# Altium project RockerBox.PrjPCB (part 2 of 2)

## Sheet SMPS.SchDoc: Title
size A1; Date: Date; CompanyName: Integrated Micro-Electronics Bulgaria; Organization: Design & Development Department; Address1: Drawing Type; Address2: Address 1; Address3: Address 2; Address4: Address 3; DocumentNumber: 730xxx; Revision: 01; SheetNumber: 1; SheetTotal: 1; PageSetup: Record=PageOptions|CenterHorizontal=True|CenterVertical=True|PrintScale=0.70|XCorrection=1.00|YCorrection=1.00|PrintKind=2|BorderSize=5000000|LeftOffset=0|BottomOffset=0|Orientation=2|PaperLength=1000|PaperWidth=1000|Scale=100|PaperSource=7|PrintQuality=-4|MediaType=1|DitherType=10|PaperKind=A4|PrintScaleMode=1; SheetSize: A3; Time: Time; ModifiedDate: Mod. Date
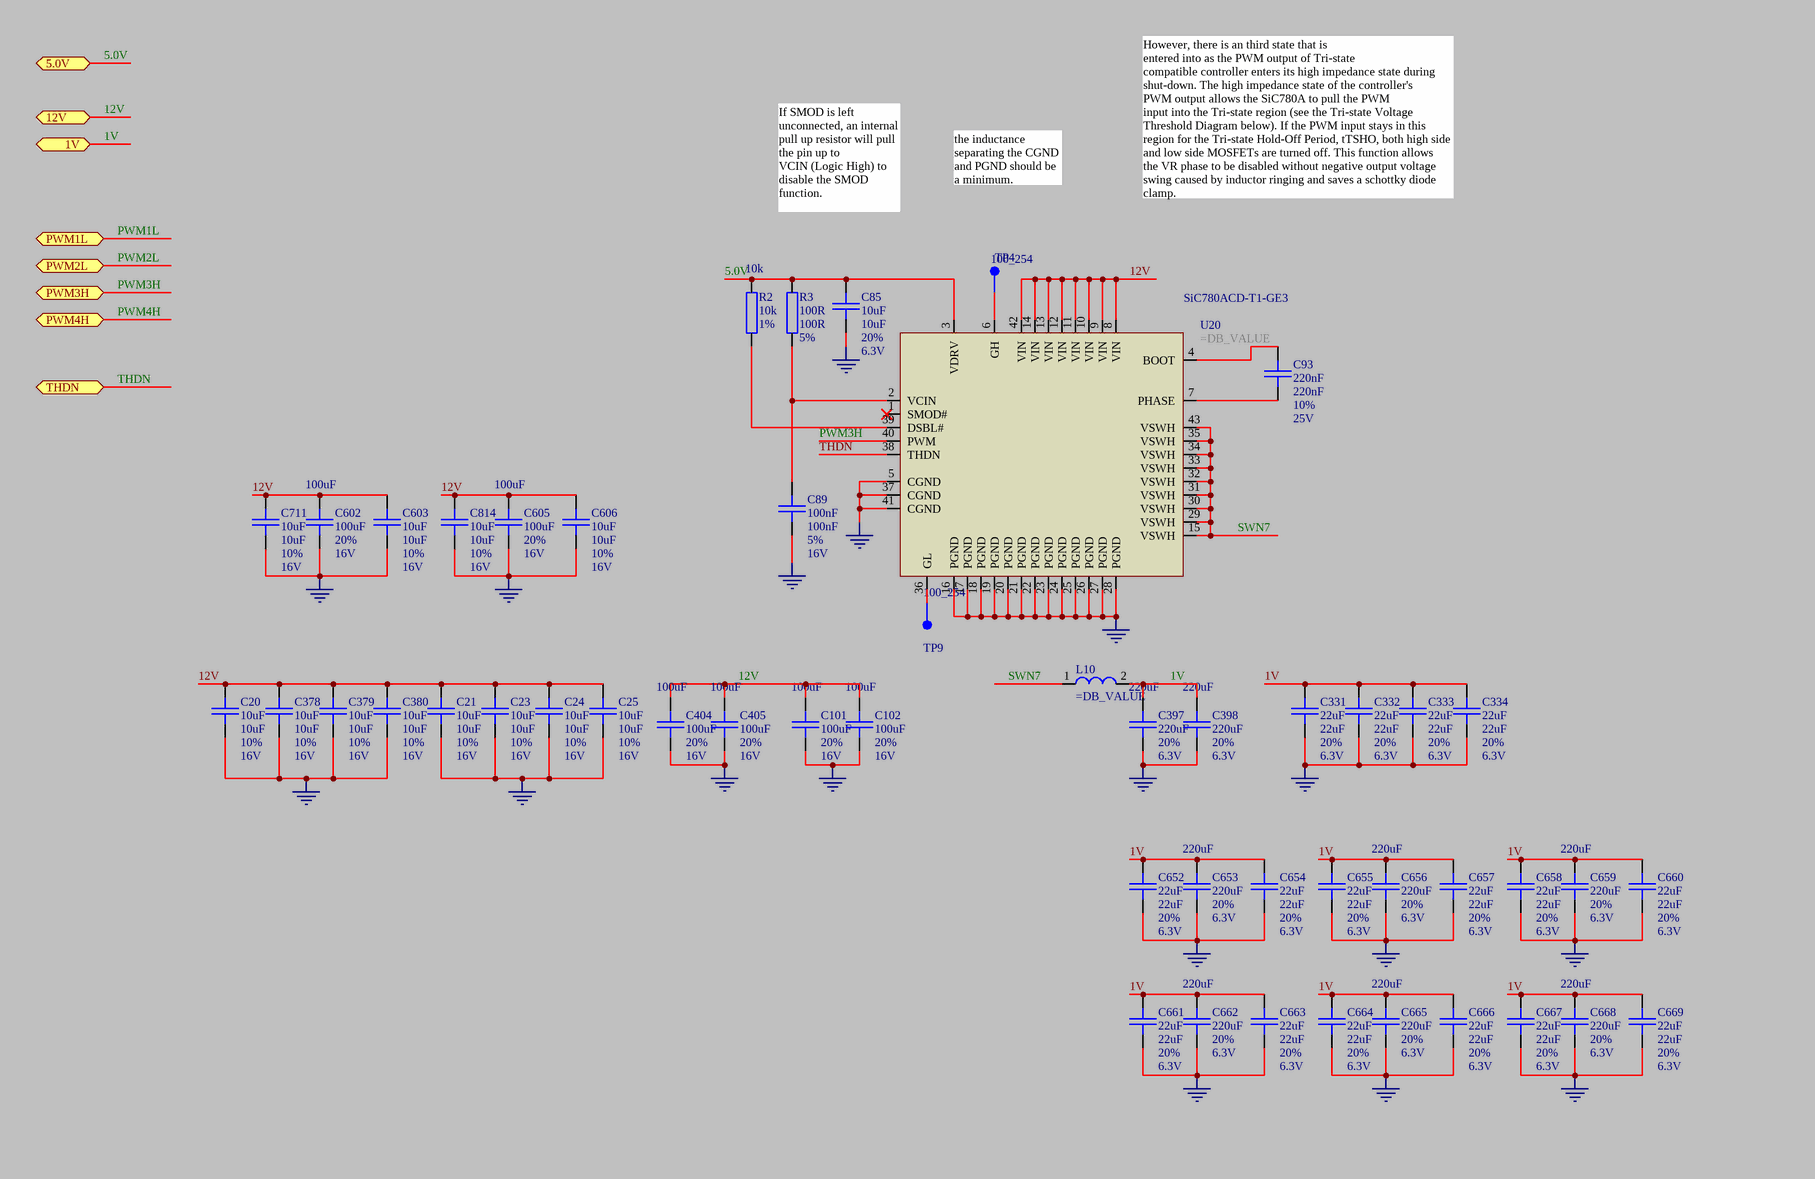
[diagram p4: SMPS.SchDoc, top left]
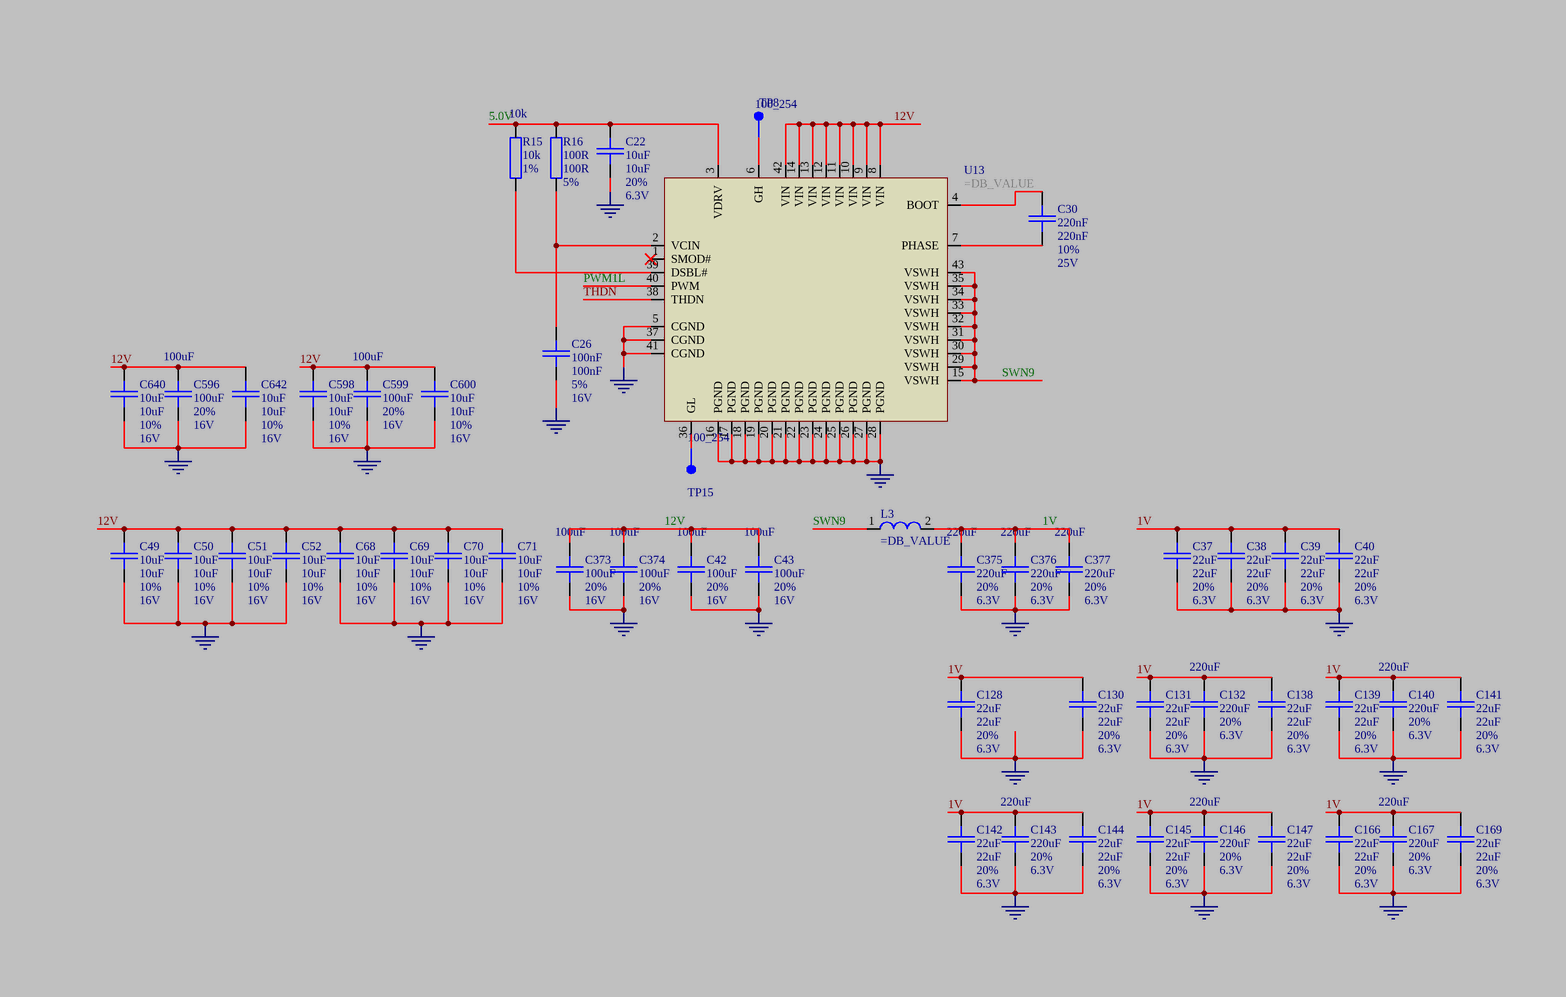
[diagram p5: SMPS.SchDoc, top right]
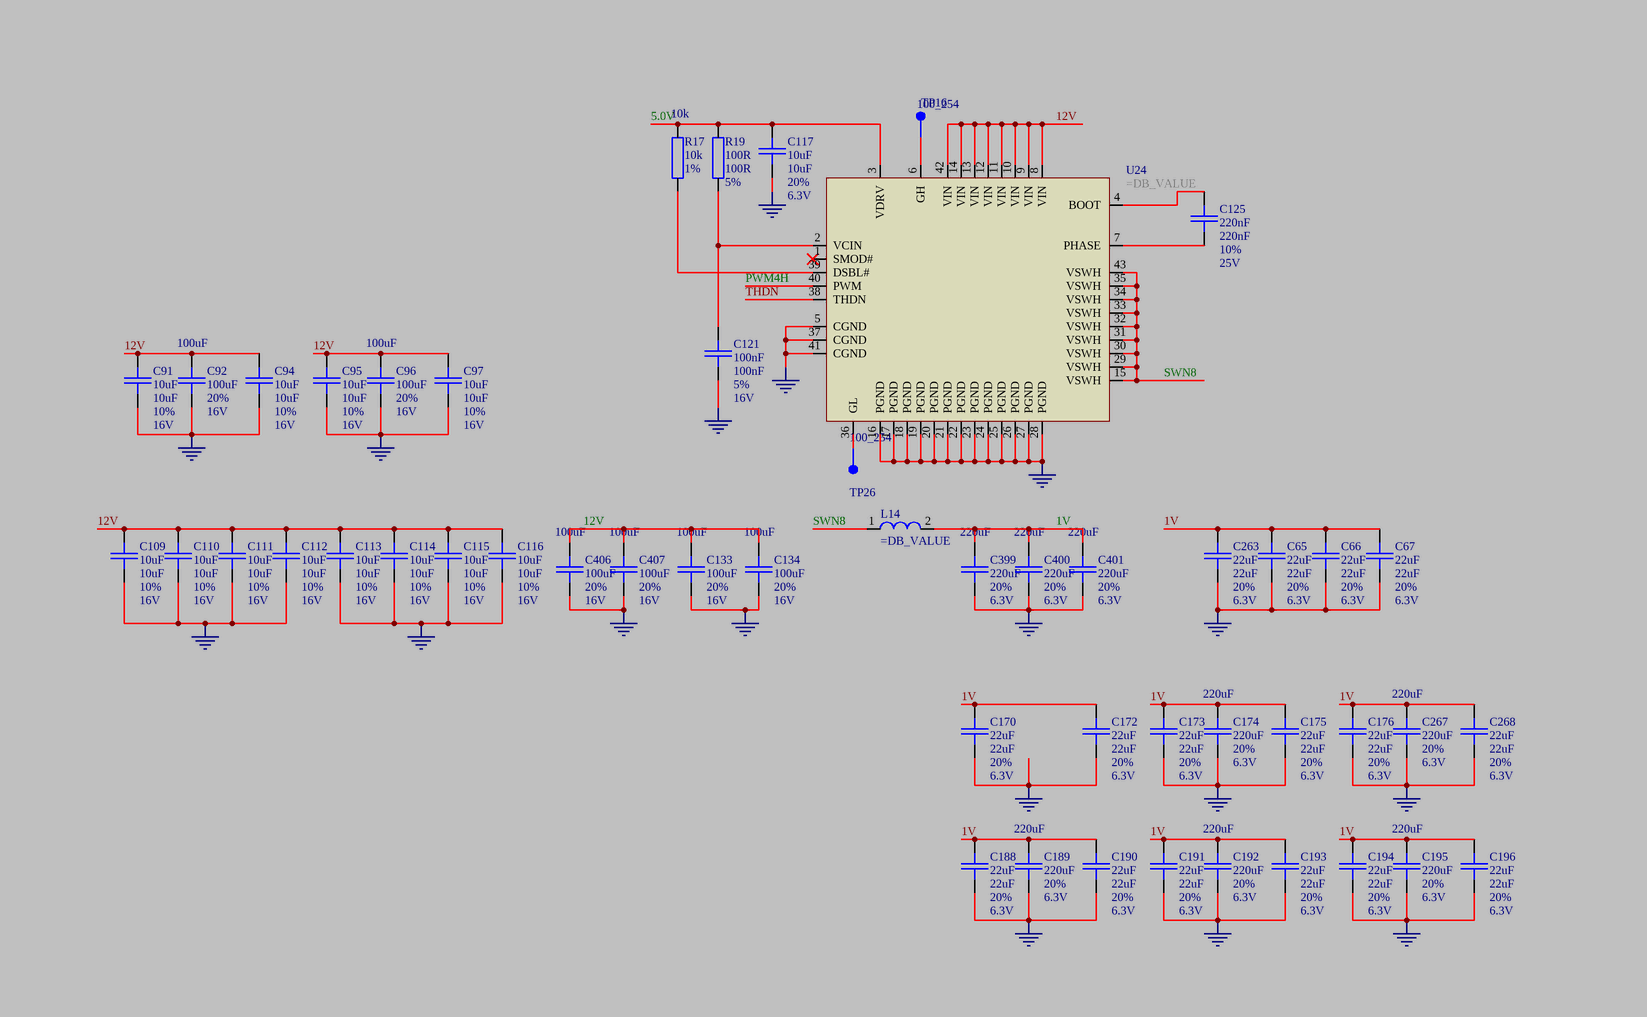
[diagram p6: SMPS.SchDoc, bottom left]
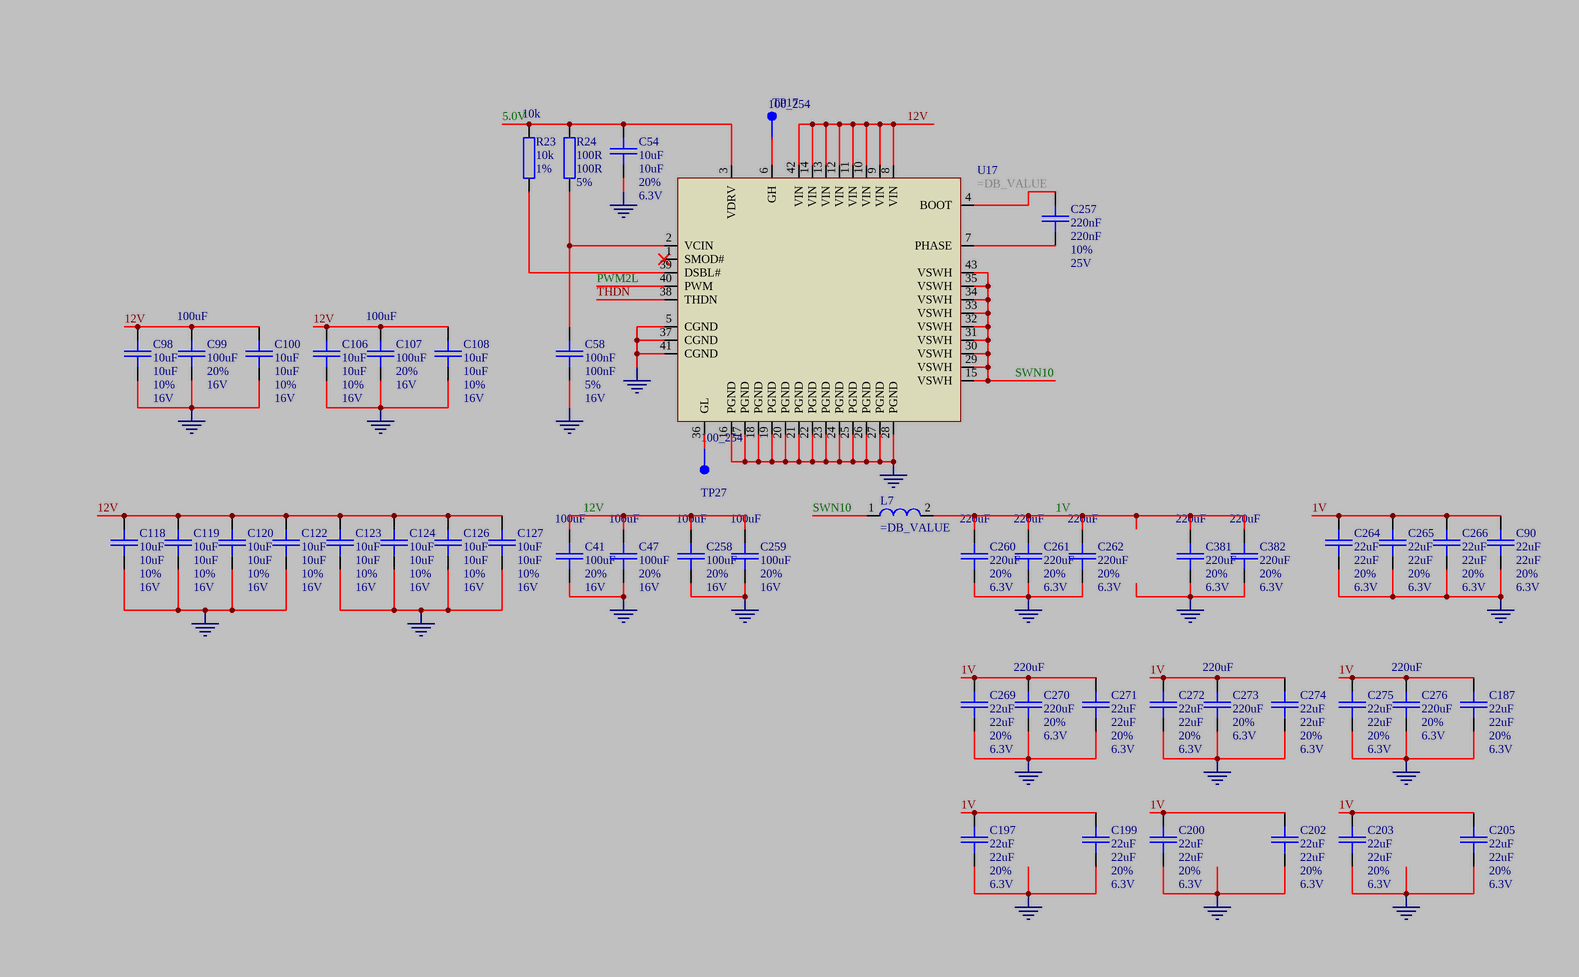
[diagram p7: SMPS.SchDoc, bottom right]

### Parts
C20  10uF  DB_TOLERANCE: 10%  DB_VOLTAGE: 16V  [SMD_0805_CAPC2012X145N]
C21  10uF  DB_TOLERANCE: 10%  DB_VOLTAGE: 16V  [SMD_0805_CAPC2012X145N]
C22  10uF  DB_TOLERANCE: 20%  DB_VOLTAGE: 6.3V  [SMD_0603_CAPC1608X95N]
C23  10uF  DB_TOLERANCE: 10%  DB_VOLTAGE: 16V  [SMD_0805_CAPC2012X145N]
C24  10uF  DB_TOLERANCE: 10%  DB_VOLTAGE: 16V  [SMD_0805_CAPC2012X145N]
C25  10uF  DB_TOLERANCE: 10%  DB_VOLTAGE: 16V  [SMD_0805_CAPC2012X145N]
C26  100nF  DB_TOLERANCE: 5%  DB_VOLTAGE: 16V  [SMD_0603_CAPC1608X95N]
C30  220nF  DB_TOLERANCE: 10%  DB_VOLTAGE: 25V  [SMD_0603_CAPC1608X95N]
C37  22uF  DB_TOLERANCE: 20%  DB_VOLTAGE: 6.3V  [SMD_0805_CAPC2012X145N]
C38  22uF  DB_TOLERANCE: 20%  DB_VOLTAGE: 6.3V  [SMD_0805_CAPC2012X145N]
C39  22uF  DB_TOLERANCE: 20%  DB_VOLTAGE: 6.3V  [SMD_0805_CAPC2012X145N]
C40  22uF  DB_TOLERANCE: 20%  DB_VOLTAGE: 6.3V  [SMD_0805_CAPC2012X145N]
C41  100uF  DB_TOLERANCE: 20%  DB_VOLTAGE: 16V  [SMD_1210_CAPC3225X270N]
C42  100uF  DB_TOLERANCE: 20%  DB_VOLTAGE: 16V  [SMD_1210_CAPC3225X270N]
C43  100uF  DB_TOLERANCE: 20%  DB_VOLTAGE: 16V  [SMD_1210_CAPC3225X270N]
C47  100uF  DB_TOLERANCE: 20%  DB_VOLTAGE: 16V  [SMD_1210_CAPC3225X270N]
C49  10uF  DB_TOLERANCE: 10%  DB_VOLTAGE: 16V  [SMD_0805_CAPC2012X145N]
C50  10uF  DB_TOLERANCE: 10%  DB_VOLTAGE: 16V  [SMD_0805_CAPC2012X145N]
C51  10uF  DB_TOLERANCE: 10%  DB_VOLTAGE: 16V  [SMD_0805_CAPC2012X145N]
C52  10uF  DB_TOLERANCE: 10%  DB_VOLTAGE: 16V  [SMD_0805_CAPC2012X145N]
C54  10uF  DB_TOLERANCE: 20%  DB_VOLTAGE: 6.3V  [SMD_0603_CAPC1608X95N]
C58  100nF  DB_TOLERANCE: 5%  DB_VOLTAGE: 16V  [SMD_0603_CAPC1608X95N]
C65  22uF  DB_TOLERANCE: 20%  DB_VOLTAGE: 6.3V  [SMD_0805_CAPC2012X145N]
C66  22uF  DB_TOLERANCE: 20%  DB_VOLTAGE: 6.3V  [SMD_0805_CAPC2012X145N]
C67  22uF  DB_TOLERANCE: 20%  DB_VOLTAGE: 6.3V  [SMD_0805_CAPC2012X145N]
C68  10uF  DB_TOLERANCE: 10%  DB_VOLTAGE: 16V  [SMD_0805_CAPC2012X145N]
C69  10uF  DB_TOLERANCE: 10%  DB_VOLTAGE: 16V  [SMD_0805_CAPC2012X145N]
C70  10uF  DB_TOLERANCE: 10%  DB_VOLTAGE: 16V  [SMD_0805_CAPC2012X145N]
C71  10uF  DB_TOLERANCE: 10%  DB_VOLTAGE: 16V  [SMD_0805_CAPC2012X145N]
C85  10uF  DB_TOLERANCE: 20%  DB_VOLTAGE: 6.3V  [SMD_0603_CAPC1608X95N]
C89  100nF  DB_TOLERANCE: 5%  DB_VOLTAGE: 16V  [SMD_0603_CAPC1608X95N]
C90  22uF  DB_TOLERANCE: 20%  DB_VOLTAGE: 6.3V  [SMD_0805_CAPC2012X145N]
C91  10uF  DB_TOLERANCE: 10%  DB_VOLTAGE: 16V  [SMD_0805_CAPC2012X145N]
C92  100uF  DB_TOLERANCE: 20%  DB_VOLTAGE: 16V  [SMD_1210_CAPC3225X270N]
C93  220nF  DB_TOLERANCE: 10%  DB_VOLTAGE: 25V  [SMD_0603_CAPC1608X95N]
C94  10uF  DB_TOLERANCE: 10%  DB_VOLTAGE: 16V  [SMD_0805_CAPC2012X145N]
C95  10uF  DB_TOLERANCE: 10%  DB_VOLTAGE: 16V  [SMD_0805_CAPC2012X145N]
C96  100uF  DB_TOLERANCE: 20%  DB_VOLTAGE: 16V  [SMD_1210_CAPC3225X270N]
C97  10uF  DB_TOLERANCE: 10%  DB_VOLTAGE: 16V  [SMD_0805_CAPC2012X145N]
C98  10uF  DB_TOLERANCE: 10%  DB_VOLTAGE: 16V  [SMD_0805_CAPC2012X145N]
C99  100uF  DB_TOLERANCE: 20%  DB_VOLTAGE: 16V  [SMD_1210_CAPC3225X270N]
C100  10uF  DB_TOLERANCE: 10%  DB_VOLTAGE: 16V  [SMD_0805_CAPC2012X145N]
C101  100uF  DB_TOLERANCE: 20%  DB_VOLTAGE: 16V  [SMD_1210_CAPC3225X270N]
C102  100uF  DB_TOLERANCE: 20%  DB_VOLTAGE: 16V  [SMD_1210_CAPC3225X270N]
C106  10uF  DB_TOLERANCE: 10%  DB_VOLTAGE: 16V  [SMD_0805_CAPC2012X145N]
C107  100uF  DB_TOLERANCE: 20%  DB_VOLTAGE: 16V  [SMD_1210_CAPC3225X270N]
C108  10uF  DB_TOLERANCE: 10%  DB_VOLTAGE: 16V  [SMD_0805_CAPC2012X145N]
C109  10uF  DB_TOLERANCE: 10%  DB_VOLTAGE: 16V  [SMD_0805_CAPC2012X145N]
C110  10uF  DB_TOLERANCE: 10%  DB_VOLTAGE: 16V  [SMD_0805_CAPC2012X145N]
C111  10uF  DB_TOLERANCE: 10%  DB_VOLTAGE: 16V  [SMD_0805_CAPC2012X145N]
C112  10uF  DB_TOLERANCE: 10%  DB_VOLTAGE: 16V  [SMD_0805_CAPC2012X145N]
C113  10uF  DB_TOLERANCE: 10%  DB_VOLTAGE: 16V  [SMD_0805_CAPC2012X145N]
C114  10uF  DB_TOLERANCE: 10%  DB_VOLTAGE: 16V  [SMD_0805_CAPC2012X145N]
C115  10uF  DB_TOLERANCE: 10%  DB_VOLTAGE: 16V  [SMD_0805_CAPC2012X145N]
C116  10uF  DB_TOLERANCE: 10%  DB_VOLTAGE: 16V  [SMD_0805_CAPC2012X145N]
C117  10uF  DB_TOLERANCE: 20%  DB_VOLTAGE: 6.3V  [SMD_0603_CAPC1608X95N]
C118  10uF  DB_TOLERANCE: 10%  DB_VOLTAGE: 16V  [SMD_0805_CAPC2012X145N]
C119  10uF  DB_TOLERANCE: 10%  DB_VOLTAGE: 16V  [SMD_0805_CAPC2012X145N]
C120  10uF  DB_TOLERANCE: 10%  DB_VOLTAGE: 16V  [SMD_0805_CAPC2012X145N]
C121  100nF  DB_TOLERANCE: 5%  DB_VOLTAGE: 16V  [SMD_0603_CAPC1608X95N]
C122  10uF  DB_TOLERANCE: 10%  DB_VOLTAGE: 16V  [SMD_0805_CAPC2012X145N]
C123  10uF  DB_TOLERANCE: 10%  DB_VOLTAGE: 16V  [SMD_0805_CAPC2012X145N]
C124  10uF  DB_TOLERANCE: 10%  DB_VOLTAGE: 16V  [SMD_0805_CAPC2012X145N]
C125  220nF  DB_TOLERANCE: 10%  DB_VOLTAGE: 25V  [SMD_0603_CAPC1608X95N]
C126  10uF  DB_TOLERANCE: 10%  DB_VOLTAGE: 16V  [SMD_0805_CAPC2012X145N]
C127  10uF  DB_TOLERANCE: 10%  DB_VOLTAGE: 16V  [SMD_0805_CAPC2012X145N]
C128  22uF  DB_TOLERANCE: 20%  DB_VOLTAGE: 6.3V  [SMD_0805_CAPC2012X145N]
C130  22uF  DB_TOLERANCE: 20%  DB_VOLTAGE: 6.3V  [SMD_0805_CAPC2012X145N]
C131  22uF  DB_TOLERANCE: 20%  DB_VOLTAGE: 6.3V  [SMD_0805_CAPC2012X145N]
C132  220uF  DB_TOLERANCE: 20%  DB_VOLTAGE: 6.3V  [SMD_1210_CAPC3225X279N]
C133  100uF  DB_TOLERANCE: 20%  DB_VOLTAGE: 16V  [SMD_1210_CAPC3225X270N]
C134  100uF  DB_TOLERANCE: 20%  DB_VOLTAGE: 16V  [SMD_1210_CAPC3225X270N]
C138  22uF  DB_TOLERANCE: 20%  DB_VOLTAGE: 6.3V  [SMD_0805_CAPC2012X145N]
C139  22uF  DB_TOLERANCE: 20%  DB_VOLTAGE: 6.3V  [SMD_0805_CAPC2012X145N]
C140  220uF  DB_TOLERANCE: 20%  DB_VOLTAGE: 6.3V  [SMD_1210_CAPC3225X279N]
C141  22uF  DB_TOLERANCE: 20%  DB_VOLTAGE: 6.3V  [SMD_0805_CAPC2012X145N]
C142  22uF  DB_TOLERANCE: 20%  DB_VOLTAGE: 6.3V  [SMD_0805_CAPC2012X145N]
C143  220uF  DB_TOLERANCE: 20%  DB_VOLTAGE: 6.3V  [SMD_1210_CAPC3225X279N]
C144  22uF  DB_TOLERANCE: 20%  DB_VOLTAGE: 6.3V  [SMD_0805_CAPC2012X145N]
C145  22uF  DB_TOLERANCE: 20%  DB_VOLTAGE: 6.3V  [SMD_0805_CAPC2012X145N]
C146  220uF  DB_TOLERANCE: 20%  DB_VOLTAGE: 6.3V  [SMD_1210_CAPC3225X279N]
C147  22uF  DB_TOLERANCE: 20%  DB_VOLTAGE: 6.3V  [SMD_0805_CAPC2012X145N]
C166  22uF  DB_TOLERANCE: 20%  DB_VOLTAGE: 6.3V  [SMD_0805_CAPC2012X145N]
C167  220uF  DB_TOLERANCE: 20%  DB_VOLTAGE: 6.3V  [SMD_1210_CAPC3225X279N]
C169  22uF  DB_TOLERANCE: 20%  DB_VOLTAGE: 6.3V  [SMD_0805_CAPC2012X145N]
C170  22uF  DB_TOLERANCE: 20%  DB_VOLTAGE: 6.3V  [SMD_0805_CAPC2012X145N]
C172  22uF  DB_TOLERANCE: 20%  DB_VOLTAGE: 6.3V  [SMD_0805_CAPC2012X145N]
C173  22uF  DB_TOLERANCE: 20%  DB_VOLTAGE: 6.3V  [SMD_0805_CAPC2012X145N]
C174  220uF  DB_TOLERANCE: 20%  DB_VOLTAGE: 6.3V  [SMD_1210_CAPC3225X279N]
C175  22uF  DB_TOLERANCE: 20%  DB_VOLTAGE: 6.3V  [SMD_0805_CAPC2012X145N]
C176  22uF  DB_TOLERANCE: 20%  DB_VOLTAGE: 6.3V  [SMD_0805_CAPC2012X145N]
C187  22uF  DB_TOLERANCE: 20%  DB_VOLTAGE: 6.3V  [SMD_0805_CAPC2012X145N]
C188  22uF  DB_TOLERANCE: 20%  DB_VOLTAGE: 6.3V  [SMD_0805_CAPC2012X145N]
C189  220uF  DB_TOLERANCE: 20%  DB_VOLTAGE: 6.3V  [SMD_1210_CAPC3225X279N]
C190  22uF  DB_TOLERANCE: 20%  DB_VOLTAGE: 6.3V  [SMD_0805_CAPC2012X145N]
C191  22uF  DB_TOLERANCE: 20%  DB_VOLTAGE: 6.3V  [SMD_0805_CAPC2012X145N]
C192  220uF  DB_TOLERANCE: 20%  DB_VOLTAGE: 6.3V  [SMD_1210_CAPC3225X279N]
C193  22uF  DB_TOLERANCE: 20%  DB_VOLTAGE: 6.3V  [SMD_0805_CAPC2012X145N]
C194  22uF  DB_TOLERANCE: 20%  DB_VOLTAGE: 6.3V  [SMD_0805_CAPC2012X145N]
C195  220uF  DB_TOLERANCE: 20%  DB_VOLTAGE: 6.3V  [SMD_1210_CAPC3225X279N]
C196  22uF  DB_TOLERANCE: 20%  DB_VOLTAGE: 6.3V  [SMD_0805_CAPC2012X145N]
C197  22uF  DB_TOLERANCE: 20%  DB_VOLTAGE: 6.3V  [SMD_0805_CAPC2012X145N]
C199  22uF  DB_TOLERANCE: 20%  DB_VOLTAGE: 6.3V  [SMD_0805_CAPC2012X145N]
C200  22uF  DB_TOLERANCE: 20%  DB_VOLTAGE: 6.3V  [SMD_0805_CAPC2012X145N]
C202  22uF  DB_TOLERANCE: 20%  DB_VOLTAGE: 6.3V  [SMD_0805_CAPC2012X145N]
C203  22uF  DB_TOLERANCE: 20%  DB_VOLTAGE: 6.3V  [SMD_0805_CAPC2012X145N]
C205  22uF  DB_TOLERANCE: 20%  DB_VOLTAGE: 6.3V  [SMD_0805_CAPC2012X145N]
C257  220nF  DB_TOLERANCE: 10%  DB_VOLTAGE: 25V  [SMD_0603_CAPC1608X95N]
C258  100uF  DB_TOLERANCE: 20%  DB_VOLTAGE: 16V  [SMD_1210_CAPC3225X270N]
C259  100uF  DB_TOLERANCE: 20%  DB_VOLTAGE: 16V  [SMD_1210_CAPC3225X270N]
C260  220uF  DB_TOLERANCE: 20%  DB_VOLTAGE: 6.3V  [SMD_1210_CAPC3225X279N]
C261  220uF  DB_TOLERANCE: 20%  DB_VOLTAGE: 6.3V  [SMD_1210_CAPC3225X279N]
C262  220uF  DB_TOLERANCE: 20%  DB_VOLTAGE: 6.3V  [SMD_1210_CAPC3225X279N]
C263  22uF  DB_TOLERANCE: 20%  DB_VOLTAGE: 6.3V  [SMD_0805_CAPC2012X145N]
C264  22uF  DB_TOLERANCE: 20%  DB_VOLTAGE: 6.3V  [SMD_0805_CAPC2012X145N]
C265  22uF  DB_TOLERANCE: 20%  DB_VOLTAGE: 6.3V  [SMD_0805_CAPC2012X145N]
C266  22uF  DB_TOLERANCE: 20%  DB_VOLTAGE: 6.3V  [SMD_0805_CAPC2012X145N]
C267  220uF  DB_TOLERANCE: 20%  DB_VOLTAGE: 6.3V  [SMD_1210_CAPC3225X279N]
C268  22uF  DB_TOLERANCE: 20%  DB_VOLTAGE: 6.3V  [SMD_0805_CAPC2012X145N]
C269  22uF  DB_TOLERANCE: 20%  DB_VOLTAGE: 6.3V  [SMD_0805_CAPC2012X145N]
C270  220uF  DB_TOLERANCE: 20%  DB_VOLTAGE: 6.3V  [SMD_1210_CAPC3225X279N]
C271  22uF  DB_TOLERANCE: 20%  DB_VOLTAGE: 6.3V  [SMD_0805_CAPC2012X145N]
C272  22uF  DB_TOLERANCE: 20%  DB_VOLTAGE: 6.3V  [SMD_0805_CAPC2012X145N]
C273  220uF  DB_TOLERANCE: 20%  DB_VOLTAGE: 6.3V  [SMD_1210_CAPC3225X279N]
C274  22uF  DB_TOLERANCE: 20%  DB_VOLTAGE: 6.3V  [SMD_0805_CAPC2012X145N]
C275  22uF  DB_TOLERANCE: 20%  DB_VOLTAGE: 6.3V  [SMD_0805_CAPC2012X145N]
C276  220uF  DB_TOLERANCE: 20%  DB_VOLTAGE: 6.3V  [SMD_1210_CAPC3225X279N]
C331  22uF  DB_TOLERANCE: 20%  DB_VOLTAGE: 6.3V  [SMD_0805_CAPC2012X145N]
C332  22uF  DB_TOLERANCE: 20%  DB_VOLTAGE: 6.3V  [SMD_0805_CAPC2012X145N]
C333  22uF  DB_TOLERANCE: 20%  DB_VOLTAGE: 6.3V  [SMD_0805_CAPC2012X145N]
C334  22uF  DB_TOLERANCE: 20%  DB_VOLTAGE: 6.3V  [SMD_0805_CAPC2012X145N]
C373  100uF  DB_TOLERANCE: 20%  DB_VOLTAGE: 16V  [SMD_1210_CAPC3225X270N]
C374  100uF  DB_TOLERANCE: 20%  DB_VOLTAGE: 16V  [SMD_1210_CAPC3225X270N]
C375  220uF  DB_TOLERANCE: 20%  DB_VOLTAGE: 6.3V  [SMD_1210_CAPC3225X279N]
C376  220uF  DB_TOLERANCE: 20%  DB_VOLTAGE: 6.3V  [SMD_1210_CAPC3225X279N]
C377  220uF  DB_TOLERANCE: 20%  DB_VOLTAGE: 6.3V  [SMD_1210_CAPC3225X279N]
C378  10uF  DB_TOLERANCE: 10%  DB_VOLTAGE: 16V  [SMD_0805_CAPC2012X145N]
C379  10uF  DB_TOLERANCE: 10%  DB_VOLTAGE: 16V  [SMD_0805_CAPC2012X145N]
C380  10uF  DB_TOLERANCE: 10%  DB_VOLTAGE: 16V  [SMD_0805_CAPC2012X145N]
C381  220uF  DB_TOLERANCE: 20%  DB_VOLTAGE: 6.3V  [SMD_1210_CAPC3225X279N]
C382  220uF  DB_TOLERANCE: 20%  DB_VOLTAGE: 6.3V  [SMD_1210_CAPC3225X279N]
C397  220uF  DB_TOLERANCE: 20%  DB_VOLTAGE: 6.3V  [SMD_1210_CAPC3225X279N]
C398  220uF  DB_TOLERANCE: 20%  DB_VOLTAGE: 6.3V  [SMD_1210_CAPC3225X279N]
C399  220uF  DB_TOLERANCE: 20%  DB_VOLTAGE: 6.3V  [SMD_1210_CAPC3225X279N]
C400  220uF  DB_TOLERANCE: 20%  DB_VOLTAGE: 6.3V  [SMD_1210_CAPC3225X279N]
C401  220uF  DB_TOLERANCE: 20%  DB_VOLTAGE: 6.3V  [SMD_1210_CAPC3225X279N]
C404  100uF  DB_TOLERANCE: 20%  DB_VOLTAGE: 16V  [SMD_1210_CAPC3225X270N]
C405  100uF  DB_TOLERANCE: 20%  DB_VOLTAGE: 16V  [SMD_1210_CAPC3225X270N]
C406  100uF  DB_TOLERANCE: 20%  DB_VOLTAGE: 16V  [SMD_1210_CAPC3225X270N]
C407  100uF  DB_TOLERANCE: 20%  DB_VOLTAGE: 16V  [SMD_1210_CAPC3225X270N]
C596  100uF  DB_TOLERANCE: 20%  DB_VOLTAGE: 16V  [SMD_1210_CAPC3225X270N]
C598  10uF  DB_TOLERANCE: 10%  DB_VOLTAGE: 16V  [SMD_0805_CAPC2012X145N]
C599  100uF  DB_TOLERANCE: 20%  DB_VOLTAGE: 16V  [SMD_1210_CAPC3225X270N]
C600  10uF  DB_TOLERANCE: 10%  DB_VOLTAGE: 16V  [SMD_0805_CAPC2012X145N]
C602  100uF  DB_TOLERANCE: 20%  DB_VOLTAGE: 16V  [SMD_1210_CAPC3225X270N]
C603  10uF  DB_TOLERANCE: 10%  DB_VOLTAGE: 16V  [SMD_0805_CAPC2012X145N]
C605  100uF  DB_TOLERANCE: 20%  DB_VOLTAGE: 16V  [SMD_1210_CAPC3225X270N]
C606  10uF  DB_TOLERANCE: 10%  DB_VOLTAGE: 16V  [SMD_0805_CAPC2012X145N]
C640  10uF  DB_TOLERANCE: 10%  DB_VOLTAGE: 16V  [SMD_0805_CAPC2012X145N]
C642  10uF  DB_TOLERANCE: 10%  DB_VOLTAGE: 16V  [SMD_0805_CAPC2012X145N]
C652  22uF  DB_TOLERANCE: 20%  DB_VOLTAGE: 6.3V  [SMD_0805_CAPC2012X145N]
C653  220uF  DB_TOLERANCE: 20%  DB_VOLTAGE: 6.3V  [SMD_1210_CAPC3225X279N]
C654  22uF  DB_TOLERANCE: 20%  DB_VOLTAGE: 6.3V  [SMD_0805_CAPC2012X145N]
C655  22uF  DB_TOLERANCE: 20%  DB_VOLTAGE: 6.3V  [SMD_0805_CAPC2012X145N]
C656  220uF  DB_TOLERANCE: 20%  DB_VOLTAGE: 6.3V  [SMD_1210_CAPC3225X279N]
C657  22uF  DB_TOLERANCE: 20%  DB_VOLTAGE: 6.3V  [SMD_0805_CAPC2012X145N]
C658  22uF  DB_TOLERANCE: 20%  DB_VOLTAGE: 6.3V  [SMD_0805_CAPC2012X145N]
C659  220uF  DB_TOLERANCE: 20%  DB_VOLTAGE: 6.3V  [SMD_1210_CAPC3225X279N]
C660  22uF  DB_TOLERANCE: 20%  DB_VOLTAGE: 6.3V  [SMD_0805_CAPC2012X145N]
C661  22uF  DB_TOLERANCE: 20%  DB_VOLTAGE: 6.3V  [SMD_0805_CAPC2012X145N]
C662  220uF  DB_TOLERANCE: 20%  DB_VOLTAGE: 6.3V  [SMD_1210_CAPC3225X279N]
C663  22uF  DB_TOLERANCE: 20%  DB_VOLTAGE: 6.3V  [SMD_0805_CAPC2012X145N]
C664  22uF  DB_TOLERANCE: 20%  DB_VOLTAGE: 6.3V  [SMD_0805_CAPC2012X145N]
C665  220uF  DB_TOLERANCE: 20%  DB_VOLTAGE: 6.3V  [SMD_1210_CAPC3225X279N]
C666  22uF  DB_TOLERANCE: 20%  DB_VOLTAGE: 6.3V  [SMD_0805_CAPC2012X145N]
C667  22uF  DB_TOLERANCE: 20%  DB_VOLTAGE: 6.3V  [SMD_0805_CAPC2012X145N]
C668  220uF  DB_TOLERANCE: 20%  DB_VOLTAGE: 6.3V  [SMD_1210_CAPC3225X279N]
C669  22uF  DB_TOLERANCE: 20%  DB_VOLTAGE: 6.3V  [SMD_0805_CAPC2012X145N]
C711  10uF  DB_TOLERANCE: 10%  DB_VOLTAGE: 16V  [SMD_0805_CAPC2012X145N]
C814  10uF  DB_TOLERANCE: 10%  DB_VOLTAGE: 16V  [SMD_0805_CAPC2012X145N]
L3  (no value)  [SMT_INDM135130X800N]
L7  (no value)  [SMT_INDM135130X800N]
L10  (no value)  [SMT_INDM135130X800N]
L14  (no value)  [SMT_INDM135130X800N]
R2  10k  DB_TOLERANCE: 1%  [SMD_0603_RESC1608X55N]
R3  100R  DB_TOLERANCE: 5%  [SMD_0603_RESC1608X55N]
R15  10k  DB_TOLERANCE: 1%  [SMD_0603_RESC1608X55N]
R16  100R  DB_TOLERANCE: 5%  [SMD_0603_RESC1608X55N]
R17  10k  DB_TOLERANCE: 1%  [SMD_0603_RESC1608X55N]
R19  100R  DB_TOLERANCE: 5%  [SMD_0603_RESC1608X55N]
R23  10k  DB_TOLERANCE: 1%  [SMD_0603_RESC1608X55N]
R24  100R  DB_TOLERANCE: 5%  [SMD_0603_RESC1608X55N]
TP4  100_254  [SMD_TP_100-254]
TP8  100_254  [SMD_TP_100-254]
TP9  100_254  [SMD_TP_100-254]
TP15  100_254  [SMD_TP_100-254]
TP16  100_254  [SMD_TP_100-254]
TP17  100_254  [SMD_TP_100-254]
TP26  100_254  [SMD_TP_100-254]
TP27  100_254  [SMD_TP_100-254]
U13  (no value)  [SMD_QFN50P600X600X80-43]
U17  (no value)  [SMD_QFN50P600X600X80-43]
U20  (no value)  [SMD_QFN50P600X600X80-43]
U24  (no value)  [SMD_QFN50P600X600X80-43]

### Ports
1V, 5.0V, 12V, PWM1L, PWM2L, PWM3H, PWM4H, THDN

### Nets
GND: C20.2 C21.2 C22.1 C23.2 C24.2 C25.2 C26.2 C37.2 C38.2 C39.2 C40.2 C41.1 C42.1 C43.1 C47.1 C49.2 C50.2 C51.2 C52.2 C54.1 C58.2 C65.2 C66.2 C67.2 C68.2 C69.2 C70.2 C71.2 C85.1 C89.2 C90.2 C91.2 C92.1 C94.2 C95.2 C96.1 C97.2 C98.2 C99.1 C100.2 C101.1 C102.1 C106.2 C107.1 C108.2 C109.2 C110.2 C111.2 C112.2 C113.2 C114.2 C115.2 C116.2 C117.1 C118.2 C119.2 C120.2 C121.2 C122.2 C123.2 C124.2 C126.2 C127.2 C128.2 C130.2 C131.2 C132.1 C133.1 C134.1 C138.2 C139.2 C140.1 C141.2 C142.2 C143.1 C144.2 C145.2 C146.1 C147.2 C166.2 C167.1 C169.2 C170.2 C172.2 C173.2 C174.1 C175.2 C176.2 C187.2 C188.2 C189.1 C190.2 C191.2 C192.1 C193.2 C194.2 C195.1 C196.2 C197.2 C199.2 C200.2 C202.2 C203.2 C205.2 C258.1 C259.1 C260.1 C261.1 C262.1 C263.2 C264.2 C265.2 C266.2 C267.1 C268.2 C269.2 C270.1 C271.2 C272.2 C273.1 C274.2 C275.2 C276.1 C331.2 C332.2 C333.2 C334.2 C373.1 C374.1 C375.1 C376.1 C377.1 C378.2 C379.2 C380.2 C381.1 C382.1 C397.1 C398.1 C399.1 C400.1 C401.1 C404.1 C405.1 C406.1 C407.1 C596.1 C598.2 C599.1 C600.2 C602.1 C603.2 C605.1 C606.2 C640.2 C642.2 C652.2 C653.1 C654.2 C655.2 C656.1 C657.2 C658.2 C659.1 C660.2 C661.2 C662.1 C663.2 C664.2 C665.1 C666.2 C667.2 C668.1 C669.2 C711.2 C814.2 U13.5(CGND) U13.16(PGND) U13.17(PGND) U13.18(PGND) U13.19(PGND) U13.20(PGND) U13.21(PGND) U13.22(PGND) U13.23(PGND) U13.24(PGND) U13.25(PGND) U13.26(PGND) U13.27(PGND) U13.28(PGND) U13.37(CGND) U13.41(CGND) U17.5(CGND) U17.16(PGND) U17.17(PGND) U17.18(PGND) U17.19(PGND) U17.20(PGND) U17.21(PGND) U17.22(PGND) U17.23(PGND) U17.24(PGND) U17.25(PGND) U17.26(PGND) U17.27(PGND) U17.28(PGND) U17.37(CGND) U17.41(CGND) U20.5(CGND) U20.16(PGND) U20.17(PGND) U20.18(PGND) U20.19(PGND) U20.20(PGND) U20.21(PGND) U20.22(PGND) U20.23(PGND) U20.24(PGND) U20.25(PGND) U20.26(PGND) U20.27(PGND) U20.28(PGND) U20.37(CGND) U20.41(CGND) U24.5(CGND) U24.16(PGND) U24.17(PGND) U24.18(PGND) U24.19(PGND) U24.20(PGND) U24.21(PGND) U24.22(PGND) U24.23(PGND) U24.24(PGND) U24.25(PGND) U24.26(PGND) U24.27(PGND) U24.28(PGND) U24.37(CGND) U24.41(CGND)
1V: C37.1 C38.1 C39.1 C40.1 C65.1 C66.1 C67.1 C90.1 C128.1 C130.1 C131.1 C132.2 C138.1 C139.1 C140.2 C141.1 C142.1 C143.2 C144.1 C145.1 C146.2 C147.1 C166.1 C167.2 C169.1 C170.1 C172.1 C173.1 C174.2 C175.1 C176.1 C187.1 C188.1 C189.2 C190.1 C191.1 C192.2 C193.1 C194.1 C195.2 C196.1 C197.1 C199.1 C200.1 C202.1 C203.1 C205.1 C260.2 C261.2 C262.2 C263.1 C264.1 C265.1 C266.1 C267.2 C268.1 C269.1 C270.2 C271.1 C272.1 C273.2 C274.1 C275.1 C276.2 C331.1 C332.1 C333.1 C334.1 C375.2 C376.2 C377.2 C381.2 C382.2 C397.2 C398.2 C399.2 C400.2 C401.2 C652.1 C653.2 C654.1 C655.1 C656.2 C657.1 C658.1 C659.2 C660.1 C661.1 C662.2 C663.1 C664.1 C665.2 C666.1 C667.1 C668.2 C669.1 L3.2 L7.2 L10.2 L14.2 ; port 1V
5.0V: C22.2 C54.2 C85.2 C117.2 R2.2 R3.1 R15.2 R16.1 R17.2 R19.1 R23.2 R24.1 U13.3(VDRV) U17.3(VDRV) U20.3(VDRV) U24.3(VDRV) ; port 5.0V
12V: C20.1 C21.1 C23.1 C24.1 C25.1 C41.2 C42.2 C43.2 C47.2 C49.1 C50.1 C51.1 C52.1 C68.1 C69.1 C70.1 C71.1 C91.1 C92.2 C94.1 C95.1 C96.2 C97.1 C98.1 C99.2 C100.1 C101.2 C102.2 C106.1 C107.2 C108.1 C109.1 C110.1 C111.1 C112.1 C113.1 C114.1 C115.1 C116.1 C118.1 C119.1 C120.1 C122.1 C123.1 C124.1 C126.1 C127.1 C133.2 C134.2 C258.2 C259.2 C373.2 C374.2 C378.1 C379.1 C380.1 C404.2 C405.2 C406.2 C407.2 C596.2 C598.1 C599.2 C600.1 C602.2 C603.1 C605.2 C606.1 C640.1 C642.1 C711.1 C814.1 U13.8(VIN) U13.9(VIN) U13.10(VIN) U13.11(VIN) U13.12(VIN) U13.13(VIN) U13.14(VIN) U13.42(VIN) U17.8(VIN) U17.9(VIN) U17.10(VIN) U17.11(VIN) U17.12(VIN) U17.13(VIN) U17.14(VIN) U17.42(VIN) U20.8(VIN) U20.9(VIN) U20.10(VIN) U20.11(VIN) U20.12(VIN) U20.13(VIN) U20.14(VIN) U20.42(VIN) U24.8(VIN) U24.9(VIN) U24.10(VIN) U24.11(VIN) U24.12(VIN) U24.13(VIN) U24.14(VIN) U24.42(VIN) ; port 12V
PWM1L: U13.40(PWM) ; port PWM1L
PWM2L: U17.40(PWM) ; port PWM2L
PWM3H: U20.40(PWM) ; port PWM3H
PWM4H: U24.40(PWM) ; port PWM4H
SWN7: L10.1 U20.15(VSWH) U20.29(VSWH) U20.30(VSWH) U20.31(VSWH) U20.32(VSWH) U20.33(VSWH) U20.34(VSWH) U20.35(VSWH) U20.43(VSWH)
SWN8: L14.1 U24.15(VSWH) U24.29(VSWH) U24.30(VSWH) U24.31(VSWH) U24.32(VSWH) U24.33(VSWH) U24.34(VSWH) U24.35(VSWH) U24.43(VSWH)
SWN9: L3.1 U13.15(VSWH) U13.29(VSWH) U13.30(VSWH) U13.31(VSWH) U13.32(VSWH) U13.33(VSWH) U13.34(VSWH) U13.35(VSWH) U13.43(VSWH)
SWN10: L7.1 U17.15(VSWH) U17.29(VSWH) U17.30(VSWH) U17.31(VSWH) U17.32(VSWH) U17.33(VSWH) U17.34(VSWH) U17.35(VSWH) U17.43(VSWH)
THDN: U13.38(THDN) U17.38(THDN) U20.38(THDN) U24.38(THDN) ; port THDN
NetC26_1: C26.1 R16.2 U13.2(VCIN)
NetC30_1: C30.1 U13.4(BOOT)
NetC30_2: C30.2 U13.7(PHASE)
NetC58_1: C58.1 R24.2 U17.2(VCIN)
NetC89_1: C89.1 R3.2 U20.2(VCIN)
NetC93_1: C93.1 U20.4(BOOT)
NetC93_2: C93.2 U20.7(PHASE)
NetC121_1: C121.1 R19.2 U24.2(VCIN)
NetC125_1: C125.1 U24.4(BOOT)
NetC125_2: C125.2 U24.7(PHASE)
NetC257_1: C257.1 U17.4(BOOT)
NetC257_2: C257.2 U17.7(PHASE)
NetR2_1: R2.1 U20.39(DSBL#)
NetR15_1: R15.1 U13.39(DSBL#)
NetR17_1: R17.1 U24.39(DSBL#)
NetR23_1: R23.1 U17.39(DSBL#)
NetTP4_1: TP4.1 U20.6(GH)
NetTP8_1: TP8.1 U13.6(GH)
NetTP9_1: TP9.1 U20.36(GL)
NetTP15_1: TP15.1 U13.36(GL)
NetTP16_1: TP16.1 U24.6(GH)
NetTP17_1: TP17.1 U17.6(GH)
NetTP26_1: TP26.1 U24.36(GL)
NetTP27_1: TP27.1 U17.36(GL)

Not connected (* = marked no-connect by the designer): U13 1(SMOD#)*; U17 1(SMOD#)*; U20 1(SMOD#)*; U24 1(SMOD#)*

### Notes on the sheet
- the inductance
  separating the CGND and PGND should be a minimum.
- However, there is an third state that is
  entered into as the PWM output of Tri-state
  compatible controller enters its high impedance state during
  shut-down. The high impedance state of the controller's
  PWM output allows the SiC780A to pull the PWM
  input into the Tri-state region (see the Tri-state Voltage
  Threshold Diagram below). If the PWM input stays in this
  region for the Tri-state Hold-Off Period, tTSHO, both high side
  and low side MOSFETs are turned off. This function allows
  the VR phase to be disabled without negative output voltage
  swing caused by inductor ringing and saves a schottky diode
  clamp.
- If SMOD is left
  unconnected, an internal pull up resistor will pull the pin up to
  VCIN (Logic High) to disable the SMOD function.
- (near U20) SiC780ACD-T1-GE3

### Library data of the parts
C20 C21 C23-C25 C49-C52 C68-C71 C91 C94 C95 C97 C98 C100 C106 C108-C116 C118-C120 C122-C124 C126 C127 C378-C380 C598 C600 C603 C606 C640 C642 C711 C814 = CAP000043636: DB_PART_TYPE: Ceramic_SMD\Standard_X5R; DB_MANUFACTURER_PART: KEMET    C0805C106K4PAC; NOTE: <NOTE>; DB_T_RANGE: -55 to 85; DB_PACKAGE: 0805; DB_DESCRIPTION: C X5R 10uF 10% 16V 0805; DB_CERTIFIED: ISHIDDEN=T; DB_APPROVED_ON: 09.10.2010 г.; DB_STATUS: NEW; DB_PART_NUMBER: CAP000043636; DB_VALUE: 10uF; DB_PCB_DEVICE: SMD_0805_CAPC2012X145N; DB_PRICE: ISHIDDEN=T; DB_LEADTIME: ISHIDDEN=T; DB_MOQ: ISHIDDEN=T; DB_PRICE_DATE: ISHIDDEN=T; DB_APPROVED_BY: ISHIDDEN=T; DB_DATASHEET: http://john.epiqdesign.com/projects/CIS_Datasheets/F3102_CE_Kemet.pdf?rev=92&sc=0
C22 C54 C85 C117 = CAP000043646: DB_MANUFACTURER_PART: KEMET    C0603C106M9PAC; DB_PART_TYPE: Ceramic_SMD\Standard_X5R; NOTE: <NOTE>; DB_APPROVED_BY: ISHIDDEN=T; DB_APPROVED_ON: 09.10.2010 г.; DB_DESCRIPTION: C X5R 10uF 20% 6.3V 0603; DB_PACKAGE: 0603; DB_STATUS: NEW; DB_T_RANGE: -55 to 85; DB_PART_NUMBER: CAP000043646; DB_VALUE: 10uF; DB_CERTIFIED: ISHIDDEN=T; DB_DATASHEET: http://john.epiqdesign.com/projects/CIS_Datasheets/F3102_CE_Kemet.pdf?rev=92&sc=0; DB_LEADTIME: ISHIDDEN=T; DB_MOQ: ISHIDDEN=T; DB_PCB_DEVICE: SMD_0603_CAPC1608X95N; DB_PRICE: ISHIDDEN=T; DB_PRICE_DATE: ISHIDDEN=T
C26 C58 C89 C121 = CAP000022706: DB_PART_TYPE: Ceramic_SMD\Open_Mode_X7R; DB_MANUFACTURER_PART: KEMET    C0603F104J4RAC; NOTE: <NOTE>; DB_T_RANGE: -55 to 125; DB_PACKAGE: 0603; DB_DESCRIPTION: C X7R 100nF 5% 16V 0603; DB_CERTIFIED: ISHIDDEN=T; DB_APPROVED_ON: 09.10.2010 г.; DB_STATUS: NEW; DB_PART_NUMBER: CAP000022706; DB_VALUE: 100nF; DB_PCB_DEVICE: SMD_0603_CAPC1608X95N; DB_PRICE: ISHIDDEN=T; DB_LEADTIME: ISHIDDEN=T; DB_MOQ: ISHIDDEN=T; DB_PRICE_DATE: ISHIDDEN=T; DB_APPROVED_BY: ISHIDDEN=T; DB_DATASHEET: http://john.epiqdesign.com/projects/CIS_Datasheets/F3102_CE_Kemet.pdf?rev=92&sc=0
C30 C93 C125 C257 = CAP000022968: DB_PART_TYPE: Ceramic_SMD\Open_Mode_X7R; DB_MANUFACTURER_PART: KEMET    C0603F224K3RAC; NOTE: <NOTE>; DB_T_RANGE: -55 to 125; DB_PACKAGE: 0603; DB_DESCRIPTION: C X7R 220nF 10% 25V 0603; DB_CERTIFIED: ISHIDDEN=T; DB_APPROVED_ON: 09.10.2010 г.; DB_STATUS: NEW; DB_PART_NUMBER: CAP000022968; DB_VALUE: 220nF; DB_PCB_DEVICE: SMD_0603_CAPC1608X95N; DB_PRICE: ISHIDDEN=T; DB_LEADTIME: ISHIDDEN=T; DB_MOQ: ISHIDDEN=T; DB_PRICE_DATE: ISHIDDEN=T; DB_APPROVED_BY: ISHIDDEN=T; DB_DATASHEET: http://john.epiqdesign.com/projects/CIS_Datasheets/F3102_CE_Kemet.pdf?rev=92&sc=0
C37-C40 C65-C67 C90 C128 C130 C131 C138 C139 C141 C142 C144 C145 C147 C166 C169 C170 C172 C173 C175 C176 C187 C188 C190 C191 C193 C194 C196 C197 C199 C200 C202 C203 C205 C263-C266 C268 C269 C271 C272 C274 C275 C331-C334 C652 C654 C655 C657 C658 C660 C661 C663 C664 C666 C667 C669 = CAP000043686: DB_PART_TYPE: Ceramic_SMD\Standard_X5R; DB_MANUFACTURER_PART: KEMET    C0805C226M9PAC; NOTE: <NOTE>; DB_T_RANGE: -55 to 85; DB_PACKAGE: 0805; DB_DESCRIPTION: C X5R 22uF 20% 6.3V 0805; DB_CERTIFIED: ISHIDDEN=T; DB_APPROVED_ON: 09.10.2010 г.; DB_STATUS: NEW; DB_PART_NUMBER: CAP000043686; DB_VALUE: 22uF; DB_PCB_DEVICE: SMD_0805_CAPC2012X145N; DB_PRICE: ISHIDDEN=T; DB_LEADTIME: ISHIDDEN=T; DB_MOQ: ISHIDDEN=T; DB_PRICE_DATE: ISHIDDEN=T; DB_APPROVED_BY: ISHIDDEN=T; DB_DATASHEET: http://john.epiqdesign.com/projects/CIS_Datasheets/F3102_CE_Kemet.pdf?rev=92&sc=0
C41-C43 C47 C92 C96 C99 C101 C102 C107 C133 C134 C258 C259 C373 C374 C404-C407 C596 C599 C602 C605 = TMP-2512: DB_PART_TYPE: Ceramic_SMD\Standard_X5R; DB_MANUFACTURER_PART: YAGEO    CC1210MRX5R7BB107; NOTE: <NOTE>; DB_T_RANGE: -55 to 85; DB_PACKAGE: 1210; DB_DESCRIPTION: C X5R 100uF 20% 16V 1210; DB_CERTIFIED: ISHIDDEN=T; DB_STATUS: NEW; DB_PART_NUMBER: TMP-2512; DB_VALUE: 100uF; DB_PCB_DEVICE: SMD_1210_CAPC3225X270N; DB_DATASHEET: http://john.epiqdesign.com/projects/CIS_Datasheets/CAP_CC1210MKX5R7BB107_100uF_16V_X5R_1210.pdf?rev=1545&sc=0
C132 C140 C143 C146 C167 C174 C189 C192 C195 C260-C262 C267 C270 C273 C276 C375-C377 C381 C382 C397-C401 C653 C656 C659 C662 C665 C668 = CAP000047355: DB_PART_TYPE: Ceramic_SMD\Standard_X5R; DB_MANUFACTURER_PART: SAMSUNG    CL32A227MQVNNNE; NOTE: <NOTE>; DB_T_RANGE: -55 to 85; DB_PACKAGE: 1210; DB_DESCRIPTION: C X5R 220uF 20% 6.3V 1210; DB_CERTIFIED: ISHIDDEN=T; DB_APPROVED_BY: VSN; DB_APPROVED_ON: 07.5.2014 г. 11:28:08; DB_STATUS: NEW; DB_PART_NUMBER: CAP000047355; DB_VALUE: 220uF; DB_PCB_DEVICE: SMD_1210_CAPC3225X279N; DB_DATASHEET: http://john.epiqdesign.com/projects/CIS_Datasheets/CAP_CL32A227MQVNNNE.pdf?rev=1401&sc=0
L3 L7 L10 L14 = L: DB_PCB_DEVICE: SMT_INDM135130X800N
R2 R15 R17 R23 = RES000008663: DB_PART_TYPE: SMD; DB_MANUFACTURER_PART: YAGEO    RC0603FR-0710KL; NOTE: <NOTE>; DB_T_RANGE: -55 to 155; DB_POWER: 1/10W; DB_PACKAGE: 0603; DB_DESCRIPTION: R SMD 10k 1% 1/10W 0603; DB_CERTIFIED: ISHIDDEN=T; DB_APPROVED_BY: VSN; DB_APPROVED_ON: 08.8.2011 г. 08:31:51; DB_STATUS: NEW; R_BDS: R; DB_PART_NUMBER: RES000008663; DB_VALUE: 10k; DB_PCB_DEVICE: SMD_0603_RESC1608X55N; DB_PRICE: ISHIDDEN=T; DB_LEADTIME: ISHIDDEN=T; DB_MOQ: ISHIDDEN=T; DB_PRICE_DATE: ISHIDDEN=T; DB_DATASHEET: http://john.epiqdesign.com/projects/CIS_Datasheets/PYu-RC0603_51_RoHS_L_4_YAGEO.pdf?rev=138&sc=0
R3 R16 R19 R24 = RES000006398: DB_PART_TYPE: SMD; DB_MANUFACTURER_PART: YAGEO    RC0603JR-07100R; NOTE: <NOTE>; DB_T_RANGE: -55 to 155; DB_POWER: 1/10W; DB_PACKAGE: 0603; DB_DESCRIPTION: R SMD 100R 5% 1/10W 0603; DB_CERTIFIED: ISHIDDEN=T; DB_PRICE: 0.000364; DB_MOQ: 5000; DB_APPROVED_ON: 09.10.2010 г.; DB_STATUS: NEW; R_BDS: R; DB_PART_NUMBER: RES000006398; DB_VALUE: 100R; DB_PCB_DEVICE: SMD_0603_RESC1608X55N; DB_PRICE_DATE: 2010-12-23; DB_APPROVED_BY: ISHIDDEN=T; DB_DATASHEET: http://john.epiqdesign.com/projects/CIS_Datasheets/PYu-RC0603_51_RoHS_L_4_YAGEO.pdf?rev=138&sc=0
TP4 TP8 TP9 TP15-TP17 TP26 TP27 = TPO000000001: DB_PART_TYPE: Test Point; DB_PACKAGE: ISHIDDEN=T; DB_DESCRIPTION: Test Point 100_254; DB_APPROVED_ON: 10.9.2010 г.; DB_STATUS: NEW; DB_PART_NUMBER: TPO000000001; DB_VALUE: 100_254; DB_DIAMETER: 100_254; DB_PCB_DEVICE: SMD_TP_100-254; DB_MANUFACTURER_PART: ISHIDDEN=T; DB_CERTIFIED: ISHIDDEN=T; DB_PRICE: ISHIDDEN=T; DB_LEADTIME: ISHIDDEN=T; DB_MOQ: ISHIDDEN=T; DB_PRICE_DATE: ISHIDDEN=T; DB_APPROVED_BY: ISHIDDEN=T; DB_DATASHEET: ISHIDDEN=T
U13 U17 U20 U24 = IC_SiC780: DB_PCB_DEVICE: SMD_QFN50P600X600X80-43

## Nets that join several sheets
GND: CPU_Logic (C227.1 C233.1 YO5.2), MCU (63 pins), SMPS (240 pins)
0.9V: CPU_Logic (C233.2 U1.A21), MCU (C231.1 C232.1 R27.1 U29.1)
1.8V: CPU_Logic (6 pins), MCU (C16.1 C17.1 U9.1)
1V: MCU (R6.2), SMPS (100 pins)
5.0V: MCU (C12.1 J3.1 R12.1 U7.3), SMPS (16 pins)
12V: MCU (9 pins), SMPS (104 pins)
PWM1L: MCU (U10.60), SMPS (U13.40)
PWM2L: MCU (U10.62), SMPS (U17.40)
PWM3H: MCU (U10.1), SMPS (U20.40)
PWM4H: MCU (U10.3), SMPS (U24.40)
RESET_COLD_L: CPU_Logic (U1.R22), MCU (R21.1 R29.1)
SER_CLK: CPU_Logic (U1.N22), MCU (R7.1 R8.1)
THDN: MCU (R9.1 U10.46), SMPS (U13.38 U17.38 U20.38 U24.38)
TXD_1: CPU_Logic (U1.U22), MCU (R20.1 R22.1)
TXD_2: CPU_Logic (U1.W22), MCU (Q51.1)

## Assembly variants
Production 220uF: not fitted C1 C18 C19 C20 C21 C23 C24 C25 C36 C37 C38 C39 C40 C49 C50 C51 C52 C62 C63 C65 C66 C67 C68 C69 C70 C71 C74 C75 C76 C77 C78 C79 C80 C81 C90 C91 C94 C95 C97 C98 C100 C106 C108 C109 C110 C111 C112 C113 C114 C115 C116 C118 C119 C120 C122 C123 C124 C126 C127 C128 C130 C131 C138 C139 C141 C142 C144 C145 C147 C148 C149 C150 C151 C152 C153 C154 C155 C156 C157 C158 C159 C160 C161 C162 C163 C164 C165 C166 C168 C169 C170 C172 C173 C175 C176 C177 C178 C179 C180 C181 C182 C183 C184 C185 C186 C187 C188 C190 C191 C193 C194 C196 C197 C199 C200 C202 C203 C205 C206 C217 C218 C219 C220 C221 C222 C223 C224 C225 C226 C228 C229 C230 C234 C235 C236 C263 C264 C265 C266 C268 C269 C271 C272 C274 C275 C331 C332 C333 C334 C378 C379 C380 C598 C600 C603 C606 C640 C642 C652 C654 C655 C657 C658 C660 C661 C663 C664 C666 C667 C669 C711 C814 J1 R4 R5 TP1 TP2 TP3 TP4 TP5 TP6 TP7 TP8 TP9 TP10 TP11 TP12 TP13 TP14 TP15 TP16 TP17 TP18 TP19 TP20 TP21 TP22 TP23 TP25 TP26 TP27 TP123 TP124 TP125 TP126 TP127 TP128 TP129 TP131 TP132
Production 1st Proto: not fitted C41 C42 C43 C47 C92 C96 C99 C101 C102 C107 C132 C133 C134 C140 C143 C146 C167 C174 C189 C192 C195 C207 C208 C209 C210 C211 C212 C213 C214 C215 C216 C237 C238 C239 C240 C241 C242 C243 C244 C245 C246 C247 C248 C249 C250 C251 C252 C253 C254 C255 C256 C258 C259 C260 C261 C262 C267 C270 C273 C276 C373 C374 C375 C376 C377 C381 C382 C397 C398 C399 C400 C401 C404 C405 C406 C407 C596 C599 C602 C605 C653 C656 C659 C662 C665 C668 J1 R4 R5 TP1 TP2 TP3 TP4 TP5 TP6 TP7 TP8 TP9 TP10 TP11 TP12 TP13 TP14 TP15 TP16 TP17 TP18 TP19 TP20 TP21 TP22 TP23 TP25 TP26 TP27 TP123 TP124 TP125 TP126 TP127 TP128 TP129 TP131 TP132